# Altium schematic sheet Sheet1.SchDoc
size A4
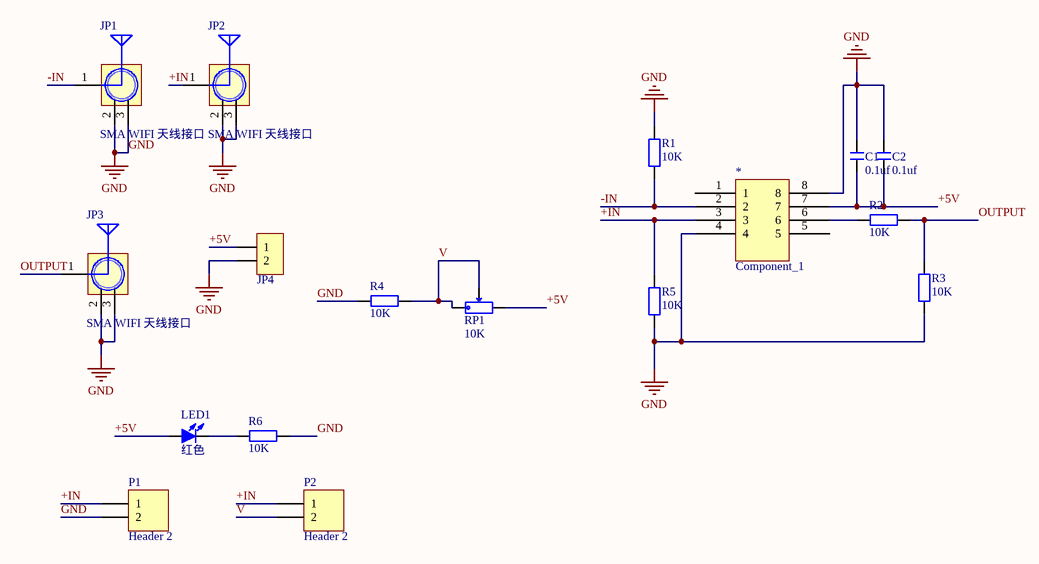
[diagram p0: Sheet1.SchDoc]

## Parts
*  Component_1  [SOP8_N]
C1  0.1uf  [C 0603_L]
C2  0.1uf  [C 0603_L]
JP1  SMA WIFI 天线接口  [SMA-KE]
JP2  SMA WIFI 天线接口  [SMA-KE]
JP3  SMA WIFI 天线接口  [SMA-KE]
JP4  HDR-1X2  [XH2.54-LI-2P]  (value not drawn)
LED1  红色  [LED 0805R]
P1  Header 2  [HDR1X2]
P2  Header 2  [HDR1X2]
R1  10K  [R 0805_L]
R2  10K  [R 0805_L]
R3  10K  [R 0805_L]
R4  10K  [R 0805_L]
R5  10K  [R 0805_L]
R6  10K  [R 0805_L]
RP1  10K  [3303W]

## Nets
GND: *.4 *.8 C1.2 C2.2 JP1.2(GND) JP1.3(GND) JP2.2(GND) JP2.3(GND) JP3.2(GND) JP3.3(GND) JP4.2 P1.2 R1.2 R3.1 R4.2 R5.2 R6.2
+5V: *.7 C1.1 C2.1 JP4.1 LED1.1(A) RP1.3
+IN: *.3 JP2.1(ANT) P1.1 P2.1 R5.1
-IN: *.2 JP1.1(ANT) R1.1
OUTPUT: JP3.1(ANT) R2.2 R3.2
V: P2.2 R4.1 RP1.1 RP1.2
Net*_6: *.6 R2.1
NetLED1_2: LED1.2(K) R6.1

Not connected (* = marked no-connect by the designer): * 1 5

## Library data of the parts
C1 C2 = C: 贴片电容; BOM名称: 无极性贴片电容; 淘宝ID: 封装库来自淘宝 ID：黄晶宝石; 联系售后，技术支持: https://shop463601444.taobao.com; 唯一出售店铺网址: https://shop463601444.taobao.com
JP1-JP3 = SMA: SMA-2.4G射频天线接口; 版权归属: 封装库来自淘宝 ID：黄晶宝石; BOM名称: SMA-2.4G射频天线接口; 唯一出售店铺网址: https://shop463601444.taobao.com
JP4 = Header 2: 2P接插件; BOM名称: 2P接插件
LED1 = LED-SMD: 贴片LED; 版权归属: 源创客; BOM名称: 贴片LED; 学习资源: www.ooocke.com
P1 P2 = Header 2: Header, 2-Pin; LatestRevisionDate: 17-Jul-2002; LatestRevisionNote: Re-released for DXP Platform.; Publisher: Altium Limited
R1-R6 = R: 贴片电阻; 版权归属: 来自淘宝 ID：黄晶宝石; 封装库来自淘宝卖家 ID：黄晶宝石: 其他店铺购入均为盗版，不享受售后技术支持服务，请立即申请退款; BOM名称: 贴片电阻; 联系售后: https://shop463601444.taobao.com
RP1 = RP-ID: 插件单联电位器; BOM名称: 插件电位器